# EAGLE design pcb-inductive-sensor2 (EAGLE 9.6.2)
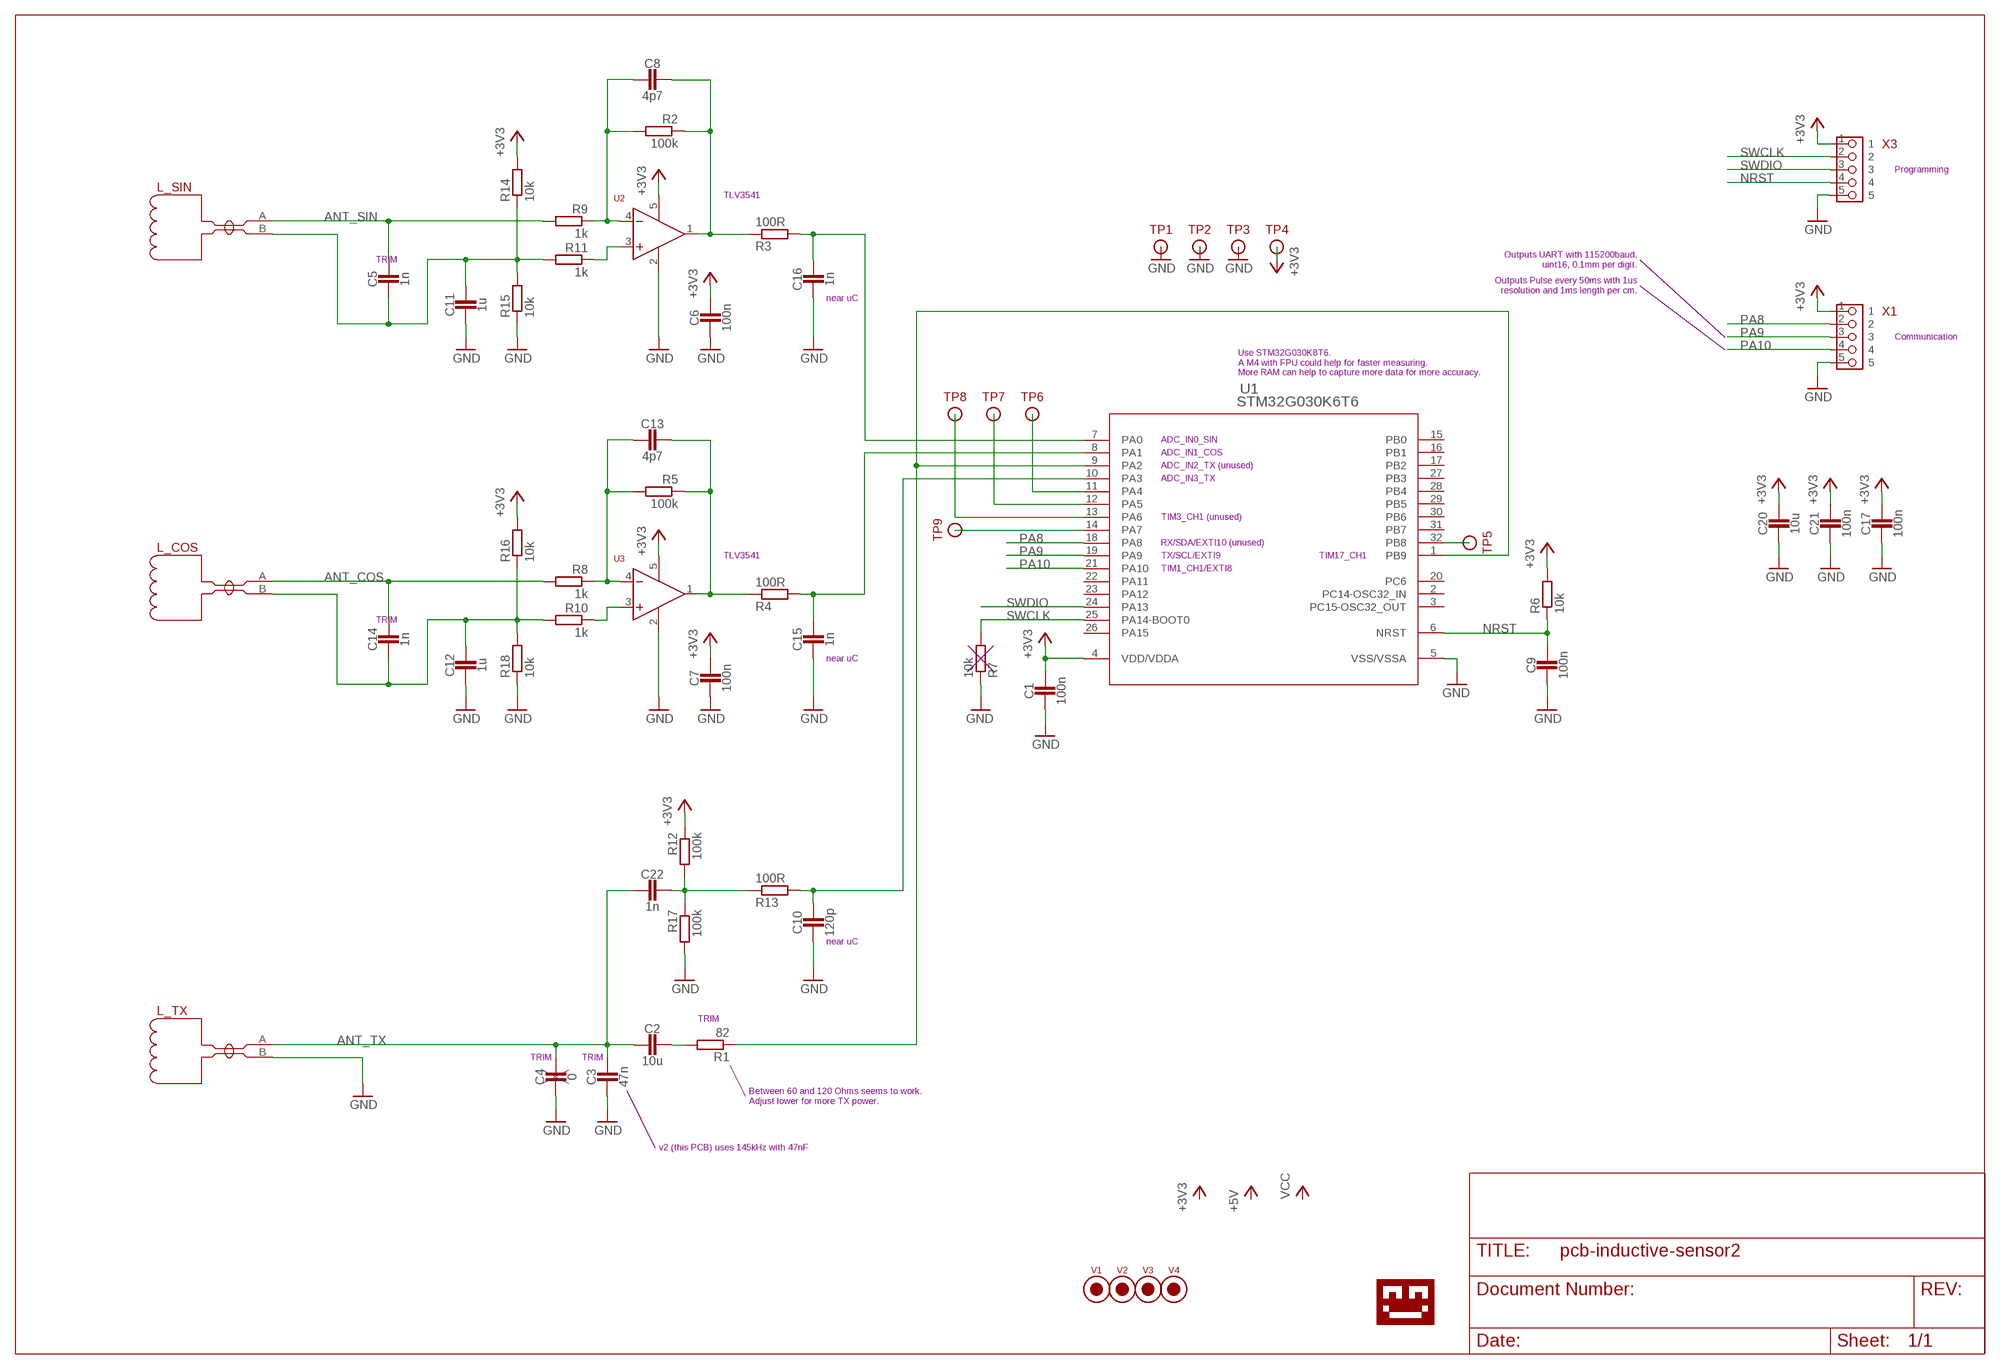
[diagram p0: schematic, sheet 1]

## Parts
C1  100n  CAPACITOR0603_CAP  [0603_CAP]
C2  10u  CAPACITOR0805_CAP  [0805_CAP]
C3  47n  CAPACITOR0603_CAP  [0603_CAP]
C4  0  CAPACITOR0603_CAP  [0603_CAP]
C5  1n  CAPACITOR0603_CAP  [0603_CAP]
C6  100n  CAPACITOR0603_CAP  [0603_CAP]
C7  100n  CAPACITOR0603_CAP  [0603_CAP]
C8  4p7  CAPACITOR0603_CAP  [0603_CAP]
C9  100n  CAPACITOR0603_CAP  [0603_CAP]
C10  120p  CAPACITOR0603_CAP  [0603_CAP]
C11  1u  CAPACITOR0603_CAP  [0603_CAP]
C12  1u  CAPACITOR0603_CAP  [0603_CAP]
C13  4p7  CAPACITOR0603_CAP  [0603_CAP]
C14  1n  CAPACITOR0603_CAP  [0603_CAP]
C15  1n  CAPACITOR0603_CAP  [0603_CAP]
C16  1n  CAPACITOR0603_CAP  [0603_CAP]
C17  100n  CAPACITOR0603_CAP  [0603_CAP]
C20  10u  CAPACITOR0805_CAP  [0805_CAP]
C21  100n  CAPACITOR0603_CAP  [0603_CAP]
C22  1n  CAPACITOR0603_CAP  [0603_CAP]
L_COS  INDUCTION_SENSOR  [INDUCTIVE_SENSOR_NET_TIE]
L_SIN  INDUCTION_SENSOR  [INDUCTIVE_SENSOR_NET_TIE]
L_TX  INDUCTION_SENSOR  [INDUCTIVE_SENSOR_NET_TIE]
R1  82  RESISTOR0805_RES  [0805_RES]
R2  100k  RESISTOR0603_RES  [0603-RES]
R3  100R  RESISTOR0603_RES  [0603-RES]
R4  100R  RESISTOR0603_RES  [0603-RES]
R5  100k  RESISTOR0603_RES  [0603-RES]
R6  10k  RESISTOR0603_RES  [0603-RES]
R7  10k  RESISTOR0603_RES  [0603-RES]
R8  1k  RESISTOR0603_RES  [0603-RES]
R9  1k  RESISTOR0603_RES  [0603-RES]
R10  1k  RESISTOR0603_RES  [0603-RES]
R11  1k  RESISTOR0603_RES  [0603-RES]
R12  100k  RESISTOR0603_RES  [0603-RES]
R13  100R  RESISTOR0603_RES  [0603-RES]
R14  10k  RESISTOR0603_RES  [0603-RES]
R15  10k  RESISTOR0603_RES  [0603-RES]
R16  10k  RESISTOR0603_RES  [0603-RES]
R17  100k  RESISTOR0603_RES  [0603-RES]
R18  10k  RESISTOR0603_RES  [0603-RES]
TP1  TESTPIN  [PIN-SMD-1X1-TEST_1M5]
TP2  TESTPIN  [PIN-SMD-1X1-TEST_1M5]
TP3  TESTPIN  [PIN-SMD-1X1-TEST_1M5]
TP4  TESTPIN  [PIN-SMD-1X1-TEST_1M5]
TP5  TESTPIN  [PIN-SMD-1X1-TEST_1M5]
TP6  TESTPIN  [PIN-SMD-1X1-TEST_1M5]
TP7  TESTPIN  [PIN-SMD-1X1-TEST_1M5]
TP8  TESTPIN  [PIN-SMD-1X1-TEST_1M5]
TP9  TESTPIN  [PIN-SMD-1X1-TEST_1M5]
U1  STM32G030K6T6  [LQFP-32]
U2  OPAMP-TLV3541IDBVT  [SOT-23-5]
U3  OPAMP-TLV3541IDBVT  [SOT-23-5]
U$1  LOGO-TOBENG-1MM-FINISH  [TOBENG-1MM-FINISH]
V1  FIDUCIAL2MM  [FIDUCIAL_2MM]
V2  FIDUCIAL2MM  [FIDUCIAL_2MM]
V3  FIDUCIAL2MM  [FIDUCIAL_2MM]
V4  FIDUCIAL2MM  [FIDUCIAL_2MM]
X1  PIN_5X1HD  [PIN_5X1_HD]
X3  PIN_5X1HD  [PIN_5X1_HD]

## Nets
+3V3: C1.1 C6.1 C7.1 C17.1 C20.P$1 C21.1 R6.2 R12.1 R14.2 R16.2 TP4.1 U1.4(VDD/VDDA) U2.5(VCC) U3.5(VCC) X1.1 X3.1
ANT_COS: C14.1 L_COS.A R8.2
ANT_SIN: C5.1 L_SIN.A R9.2
ANT_TX: C2.P$2 C3.1 C4.1 C22.2 L_TX.A
ANT_TX1: R1.1 U1.1(PB9) U1.9(PA2)
GND: C1.2 C3.2 C4.2 C6.2 C7.2 C9.2 C10.2 C11.2 C12.2 C15.2 C16.2 C17.2 C20.P$2 C21.2 L_TX.B R7.1 R15.1 R17.2 R18.1 TP1.1 TP2.1 TP3.1 U1.5(VSS/VSSA) U2.2(GND) U3.2(GND) X1.5 X3.5
N$1: C16.1 R3.2 U1.7(PA0)
N$2: C15.1 R4.2 U1.8(PA1)
N$3: C10.1 R13.2 U1.10(PA3)
N$4: TP6.1 U1.11(PA4)
N$5: TP7.1 U1.12(PA5)
N$6: TP8.1 U1.13(PA6)
N$7: TP9.1 U1.14(PA7)
N$8: C8.1 R2.1 R3.1 U2.1(OUT)
N$9: C8.2 R2.2 R9.1 U2.4(-)
N$10: TP5.1 U1.32(PB8)
N$11: C13.1 R4.1 R5.1 U3.1(OUT)
N$12: C13.2 R5.2 R8.1 U3.4(-)
N$13: C22.1 R12.2 R13.1 R17.1
N$14: R11.1 U2.3(+)
N$15: R10.1 U3.3(+)
N$16: C2.P$1 R1.2
N$17: C12.1 C14.2 L_COS.B R10.2 R16.1 R18.2
N$18: C5.2 C11.1 L_SIN.B R11.2 R14.1 R15.2
NRST: C9.1 R6.1 U1.6(NRST) X3.4
PA8: U1.18(PA8) X1.2
PA9: U1.19(PA9) X1.3
PA10: U1.21(PA10) X1.4
SWCLK: R7.2 U1.25(PA14-BOOT0) X3.2
SWDIO: U1.24(PA13) X3.3
Unconnected: U1.2(PC14-OSC32_IN) U1.3(PC15-OSC32_OUT) U1.15(PB0) U1.16(PB1) U1.17(PB2) U1.20(PC6) U1.22(PA11) U1.23(PA12) U1.26(PA15) U1.27(PB3) U1.28(PB4) U1.29(PB5) U1.30(PB6) U1.31(PB7)

## Notes on the sheet
- Programming
- TLV3541
- TRIM
- Outputs UART with 115200baud,
  uint16, 0.1mm per digit.
- Outputs Pulse every 50ms with 1us
  resolution and 1ms length per cm.
- near uC
- Communication
- Use STM32G030K8T6.
  A M4 with FPU could help for faster measuring.
  More RAM can help to capture more data for more accuracy.
- ADC_IN0_SIN
- ADC_IN1_COS
- ADC_IN2_TX (unused)
- ADC_IN3_TX
- TIM3_CH1 (unused)
- RX/SDA/EXTI10 (unused)
- TLV3541 | TX/SCL/EXTI9 | TIM17_CH1
- TIM1_CH1/EXTI8
- TRIM
- near uC
- near uC
- TRIM
- TRIM | TRIM
- Between 60 and 120 Ohms seems to work.
  Adjust lower for more TX power.
- v2 (this PCB) uses 145kHz with 47nF

## Library data of the parts
C1-C17 C20-C22 = passives:CAPACITOR: SMD Capacitor
L_COS L_SIN L_TX = ftobler:INDUCTION_SENSOR
R1-R18 = passives:RESISTOR: Resistor Basic schematic elements and footprints for 0201, 0402, 0603, 1206, and PTH resistors.
TP1-TP9 = ftobler:TESTPIN
U1 = stm32:STM32G030K6T6; BUILT_BY: EMA_UL_Team; COPYRIGHT: Copyright (C) 2018 Accelerated Designs. All rights reserved; MANUFACTURER_PART_NUMBER: STM32G030K6T6; SOURCELIBRARY: Updates_to_database_2020-10-19; VENDOR: STMicroelectronics
U2 U3 = ftobler:OPAMP
U$1 = ftobler:LOGO
V1-V4 = ftobler:FIDUCIAL
X1 X3 = ftobler-conn:PIN_5X1

## Board
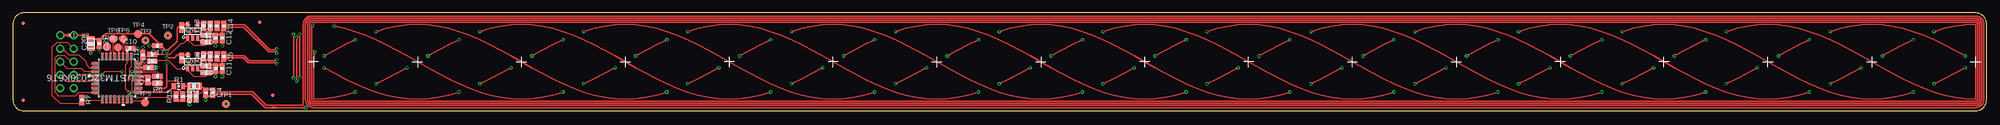
[diagram p1: board, top side]
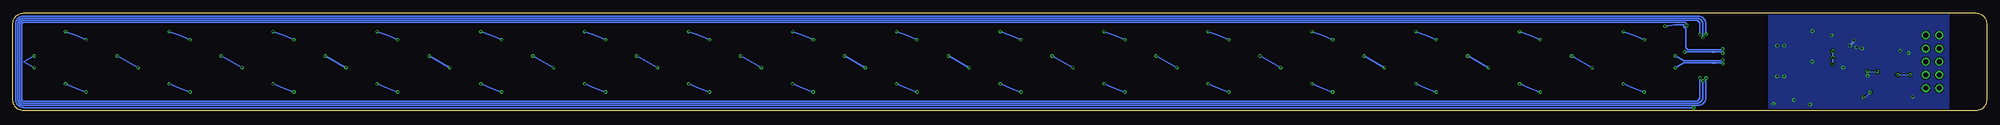
[diagram p2: board, bottom side, seen from below]

Size 380 x 18.8 mm. Coordinates in mm from the lower left corner, seen from the top.
Outline: 0,16.8 0,2 arc90 2,0 378,0 arc90 380,2 380,16.8 arc90 378,18.8 2,18.8 arc90 0,16.8
Copper layers (1*16): Top 0.035mm / dielectric 1.5mm / Bottom 0.035mm
Design rules "default *": minimum track width 0.15mm, minimum drill 0.3mm, track to track 0.15mm, track to pad 0.15mm, pad to pad 0.15mm, via to via 0.15mm, smd to smd 0.15mm, copper to edge 0.3mm, drill to drill 10mil, minimum pad ring 0.15mm, minimum via ring 0.15mm, stop-mask expansion 0.05mm, vias tented up to drill 0.35mm, thermal gap 0.2mm

### Footprints (pad centres in the part's own frame; a part is rotated, then mirrored left to right if it is on the bottom)
0603_CAP = smd 0.7 x 1: 1 -0.65,0; 2 0.65,0
0805_CAP = smd 0.8 x 1.4: P$1 1,0; P$2 -1,0
INDUCTIVE_SENSOR_NET_TIE = smd 0.2 x 0.2: A -0.2,0; B 0.2,0
0805_RES = smd 0.8 x 1.2: 1 -0.9,0; 2 0.9,0
0603-RES = smd 0.7 x 1: 1 -0.65,0; 2 0.65,0
PIN-SMD-1X1-TEST_1M5 = smd 1.5 x 1.5: 1 0,0
LQFP-32 = smd 1.473 x 0.508: 1 -4.115,2.8; 2 -4.115,2; 3 -4.115,1.2; 4 -4.115,0.4; 5 -4.115,-0.4; 6 -4.115,-1.2; 7 -4.115,-2; 8 -4.115,-2.8; 17 4.115,-2.8; 18 4.115,-2; 19 4.115,-1.2; 20 4.115,-0.4; 21 4.115,0.4; 22 4.115,1.2; 23 4.115,2; 24 4.115,2.8 | smd 0.508 x 1.473: 9 -2.8,-4.115; 10 -2,-4.115; 11 -1.2,-4.115; 12 -0.4,-4.115; 13 0.4,-4.115; 14 1.2,-4.115; 15 2,-4.115; 16 2.8,-4.115; 25 2.8,4.115; 26 2,4.115; 27 1.2,4.115; 28 0.4,4.115; 29 -0.4,4.115; 30 -1.2,4.115; 31 -2,4.115; 32 -2.8,4.115
SOT-23-5 = smd 1 x 0.55: 1 -1.35,0.95; 2 -1.35,0; 3 -1.35,-0.95; 4 1.35,-0.95; 5 1.35,0.95
FIDUCIAL_2MM = smd 0.7 x 0.7: V 0,0
PIN_5X1_HD = drill 0.9 pad 1.54 octagon: 1 0,0 | drill 0.9 pad 1.54: 2 0,-2.54; 3 0,-5.08; 4 0,-7.62; 5 0,-10.16

### Placement (x,y rotation side)
C1  26,5.9 90 top
C2  34.9,4.7 180 top
C3  37.1,3.45 270 top
C4  38.45,3.45 270 top
C5  40.6,10.4 270 top
C6  32.5,10.1 270 top
C7  32.5,16 270 top
C8  36.7,10.4 90 top
C9  27.8,6.6 180 top
C10  22.5,12 0 top
C11  40.3,8.1 270 top
C12  40.3,14 270 top
C13  36.7,16.3 90 top
C14  40.6,16.3 270 top
C15  25,10.7 90 top
C16  26.1,8.3 0 top
C17  27.8,12.5 180 top
C20  15,12.9 90 top
C21  16.6,12.9 270 top
C22  35.3,2.7 90 top
L_COS  52.5,11.3 0 bottom
L_SIN  52.5,9.2 0 bottom
L_TX  50.3,0.6 180 top
R1  31.9,4.7 0 top
R2  38,10.4 90 top
R3  26.8,9.5 180 top
R4  26.8,10.8 180 top
R5  38,16.3 90 top
R6  27.8,5.3 180 top
R7  13.25,2.05 270 top
R8  39.3,16.3 90 top
R9  39.3,10.4 90 top
R10  37.2,13.2 0 top
R11  37.2,7.3 0 top
R12  32.7,2.7 270 top
R13  31.4,2.7 90 top
R14  37.2,8.6 180 top
R15  39,8.1 90 top
R16  37.2,14.5 180 top
R17  34,2.7 270 top
R18  39,14 90 top
TP1  41,1.3 0 top
TP2  29.8,14.5 0 top
TP3  25.55,13.55 0 top
TP4  24.1,14.8 0 top
TP5  25.4,1.6 0 top
TP6  21.25,13.75 0 top
TP7  20.2,12.15 0 top
TP8  19.3,13.75 0 top
TP9  18.1,12.3 0 top
U1  20,6.3 180 top
U2  34.6,9.4 90 top
U3  34.6,15.3 90 top
U$1  47.6,9.4 0 top
V1  2,16.8 0 top
V2  47.5,17 0 top
V3  50,3 0 top
V4  2,2 0 top
X1  9.1,14.5 0 top
X3  11.7,14.5 0 top

### Tracks (layer width: path | path; a pad name or v marks a point on that pad's centre or on a via)
+3V3  (via drill 0.35)
  Top 0.2: C1.1 26.05,5.3 | R14.2 35.75,9.4 34.8,9.4 33.65,10.55 U2.5 | R16.2 35.75,15.3 34.8,15.3 33.65,16.45 U3.5 | R12.1 31.8,4.25 31.8,5.4 31.5,5.7 29.6,5.7
  Top 0.3: 26.05,5.3 R6.2 27.15,5.25 28.1,4.3 29.3,4.3 29.6,4.6 29.6,5.7 v29.6,9.03 | U1.4 25.2,5.9 25.85,5.25 C1.1 | X3.1 14.2,14.5 14.8,13.9 C20.P$1 15.2,13.7 16.45,13.7 C21.1 17.85,14.8 TP4.1 26.2,14.8 28.5,12.5 | U2.5 C6.1 31.65,10.75 31.1,10.2 v29.6,10.2 | U3.5 C7.1 32.4,16.65 31.6,15.85 31.6,13.4 v29.6,11.4 28.55,12.45 28.5,12.5 | C17.1 28.5,12.5
  Top 0.5: X1.1 X3.1
  Bottom 0.3: v29.6,9.03 v29.6,10.2 v29.6,11.4
ANT_COS  (via drill 0.3 pad 0.6)
  Top 0.2: C14.1 R8.2
  Top 0.25: v119.9,10.53 121.9,11.62 123.9,12.67 v125.9,13.63 | v129.9,15.22 131.9,15.82 133.9,16.25 135.9,16.51 137.9,16.6 139.9,16.51 141.9,16.25 143.9,15.82 145.9,15.22 147.9,14.49 149.9,13.63 151.9,12.67 153.9,11.62 155.9,10.53 159.9,8.27 161.9,7.18 163.9,6.13 165.9,5.17 167.9,4.31 169.9,3.58 171.9,2.98 173.9,2.55 175.9,2.29 177.9,2.2 179.9,2.29 181.9,2.55 183.9,2.98 v185.9,3.58 | v115.9,8.27 113.9,7.18 111.9,6.13 v109.9,5.17 | v105.9,3.58 103.9,2.98 101.9,2.55 99.9,2.29 97.9,2.2 95.9,2.29 93.9,2.55 91.9,2.98 89.9,3.58 87.9,4.31 85.9,5.17 83.9,6.13 81.9,7.18 79.9,8.27 75.9,10.53 73.9,11.62 71.9,12.67 69.9,13.63 67.9,14.49 65.9,15.22 63.9,15.82 v61.9,16.25 | v199.9,10.53 201.9,11.62 203.9,12.67 v205.9,13.63 | v209.9,15.22 211.9,15.82 213.9,16.25 215.9,16.51 217.9,16.6 219.9,16.51 221.9,16.25 223.9,15.82 225.9,15.22 227.9,14.49 229.9,13.63 231.9,12.67 233.9,11.62 235.9,10.53 239.9,8.27 241.9,7.18 243.9,6.13 245.9,5.17 247.9,4.31 249.9,3.58 251.9,2.98 253.9,2.55 255.9,2.29 257.9,2.2 259.9,2.29 261.9,2.55 263.9,2.98 v265.9,3.58 | v195.9,8.27 193.9,7.18 191.9,6.13 v189.9,5.17 | v279.9,10.53 281.9,11.62 283.9,12.67 v285.9,13.63 | v289.9,15.22 291.9,15.82 293.9,16.25 295.9,16.51 297.9,16.6 299.9,16.51 301.9,16.25 303.9,15.82 305.9,15.22 307.9,14.49 309.9,13.63 311.9,12.67 313.9,11.62 315.9,10.53 319.9,8.27 321.9,7.18 323.9,6.13 325.9,5.17 327.9,4.31 329.9,3.58 331.9,2.98 333.9,2.55 335.9,2.29 337.9,2.2 339.9,2.29 341.9,2.55 343.9,2.98 v345.9,3.58 | v275.9,8.27 273.9,7.18 271.9,6.13 v269.9,5.17 | v359.9,10.53 361.9,11.62 363.9,12.67 v365.9,13.63
  Top 0.25: v369.9,15.22 371.9,15.82 373.9,16.25 375.9,16.51 377.9,16.6 377.9,2.2 375.9,2.29 373.9,2.55 371.9,2.98 369.9,3.58 367.9,4.31 365.9,5.17 363.9,6.13 361.9,7.18 359.9,8.27 355.9,10.53 353.9,11.62 351.9,12.67 349.9,13.63 347.9,14.49 345.9,15.22 343.9,15.82 341.9,16.25 339.9,16.51 337.9,16.6 335.9,16.51 333.9,16.25 331.9,15.82 v329.9,15.22 | v355.9,8.27 353.9,7.18 351.9,6.13 v349.9,5.17 | v155.9,8.27 153.9,7.18 151.9,6.13 v149.9,5.17 | v145.9,3.58 143.9,2.98 141.9,2.55 139.9,2.29 137.9,2.2 135.9,2.29 133.9,2.55 131.9,2.98 129.9,3.58 127.9,4.31 125.9,5.17 123.9,6.13 121.9,7.18 119.9,8.27 115.9,10.53 113.9,11.62 111.9,12.67 109.9,13.63 107.9,14.49 105.9,15.22 103.9,15.82 101.9,16.25 99.9,16.51 97.9,16.6 95.9,16.51 93.9,16.25 91.9,15.82 v89.9,15.22 | v79.9,10.53 81.9,11.62 83.9,12.67 v85.9,13.63 | v235.9,8.27 233.9,7.18 231.9,6.13 v229.9,5.17 | v225.9,3.58 223.9,2.98 221.9,2.55 219.9,2.29 217.9,2.2 215.9,2.29 213.9,2.55 211.9,2.98 209.9,3.58 207.9,4.31 205.9,5.17 203.9,6.13 201.9,7.18 199.9,8.27 195.9,10.53 193.9,11.62 191.9,12.67 189.9,13.63 187.9,14.49 185.9,15.22 183.9,15.82 181.9,16.25 179.9,16.51 177.9,16.6 175.9,16.51 173.9,16.25 171.9,15.82 v169.9,15.22 | v159.9,10.53 161.9,11.62 163.9,12.67 v165.9,13.63 | v315.9,8.27 313.9,7.18 311.9,6.13 v309.9,5.17 | v305.9,3.58 303.9,2.98 301.9,2.55 299.9,2.29 297.9,2.2 295.9,2.29 293.9,2.55 291.9,2.98 289.9,3.58 287.9,4.31 285.9,5.17 283.9,6.13 281.9,7.18 279.9,8.27 275.9,10.53 273.9,11.62 271.9,12.67 269.9,13.63 267.9,14.49 265.9,15.22 263.9,15.82 261.9,16.25 259.9,16.51 257.9,16.6 255.9,16.51 253.9,16.25 251.9,15.82 v249.9,15.22
  Top 0.25: v239.9,10.53 241.9,11.62 243.9,12.67 v245.9,13.63 | v319.9,10.53 321.9,11.62 323.9,12.67 v325.9,13.63 | v75.9,8.27 73.9,7.18 71.9,6.13 v69.9,5.17 | v65.9,3.58 63.9,2.98 61.9,2.55 59.9,2.29 57.9,2.2 57.9,10.1 v58.1,11.3 | C14.1 40.75,16.95 41.2,16.5 44.6,16.5 49.4,11.7 50.6,11.7 v50.8,11.9
  Bottom 0.25: v125.9,13.63 127.9,14.49 v129.9,15.22 | v119.9,10.53 v115.9,8.27 | v109.9,5.17 107.9,4.31 v105.9,3.58 | v205.9,13.63 207.9,14.49 v209.9,15.22 | v199.9,10.53 v195.9,8.27 | v189.9,5.17 187.9,4.31 v185.9,3.58 | v285.9,13.63 287.9,14.49 v289.9,15.22 | v279.9,10.53 v275.9,8.27 | v269.9,5.17 267.9,4.31 v265.9,3.58 | v365.9,13.63 367.9,14.49 v369.9,15.22 | v359.9,10.53 v355.9,8.27 | v349.9,5.17 347.9,4.31 v345.9,3.58 | v61.9,16.25 59.9,16.51 58.3,16.58 58.3,16.4 arc-53 58.06,15.92 57.9,15.8 57.9,12.1 57.5,11.7 51,11.7 v50.8,11.9 | v149.9,5.17 147.9,4.31 v145.9,3.58 | v85.9,13.63 87.9,14.49 v89.9,15.22 | v229.9,5.17 227.9,4.31 v225.9,3.58 | v155.9,8.27 v159.9,10.53 | v165.9,13.63 167.9,14.49 v169.9,15.22 | v309.9,5.17 307.9,4.31 v305.9,3.58 | v235.9,8.27 v239.9,10.53 | v245.9,13.63 247.9,14.49 v249.9,15.22 | v315.9,8.27 v319.9,10.53 | v325.9,13.63 327.9,14.49 v329.9,15.22 | v79.9,10.53 v75.9,8.27 | v69.9,5.17 67.9,4.31 v65.9,3.58 | v58.1,11.3 L_COS.A
ANT_SIN  (via drill 0.3 pad 0.6)
  Top 0.2: C5.1 R9.2
  Top 0.25: v135.9,8.27 133.9,7.18 131.9,6.13 v129.9,5.17 | v125.9,3.58 123.9,2.98 121.9,2.55 119.9,2.29 117.9,2.2 115.9,2.29 113.9,2.55 111.9,2.98 109.9,3.58 107.9,4.31 105.9,5.17 103.9,6.13 101.9,7.18 99.9,8.27 95.9,10.53 93.9,11.62 91.9,12.67 89.9,13.63 87.9,14.49 85.9,15.22 83.9,15.82 81.9,16.25 79.9,16.51 77.9,16.6 75.9,16.51 73.9,16.25 71.9,15.82 v69.9,15.22 | v59.9,10.53 61.9,11.62 63.9,12.67 v65.9,13.63 | v215.9,8.27 213.9,7.18 211.9,6.13 v209.9,5.17 | v205.9,3.58 203.9,2.98 201.9,2.55 199.9,2.29 197.9,2.2 195.9,2.29 193.9,2.55 191.9,2.98 189.9,3.58 187.9,4.31 185.9,5.17 183.9,6.13 181.9,7.18 179.9,8.27 175.9,10.53 173.9,11.62 171.9,12.67 169.9,13.63 167.9,14.49 165.9,15.22 163.9,15.82 161.9,16.25 159.9,16.51 157.9,16.6 155.9,16.51 153.9,16.25 151.9,15.82 v149.9,15.22 | v139.9,10.53 141.9,11.62 143.9,12.67 v145.9,13.63 | v295.9,8.27 293.9,7.18 291.9,6.13 v289.9,5.17 | v285.9,3.58 283.9,2.98 281.9,2.55 279.9,2.29 277.9,2.2 275.9,2.29 273.9,2.55 271.9,2.98 269.9,3.58 267.9,4.31 265.9,5.17 263.9,6.13 261.9,7.18 259.9,8.27 255.9,10.53 253.9,11.62 251.9,12.67 249.9,13.63 247.9,14.49 245.9,15.22 243.9,15.82 241.9,16.25 239.9,16.51 237.9,16.6 235.9,16.51 233.9,16.25 231.9,15.82 v229.9,15.22 | v219.9,10.53 221.9,11.62 223.9,12.67 v225.9,13.63 | v375.9,8.27 373.9,7.18 371.9,6.13 v369.9,5.17 | v365.9,3.58 363.9,2.98 361.9,2.55 359.9,2.29 357.9,2.2 355.9,2.29 353.9,2.55 351.9,2.98 349.9,3.58 347.9,4.31 345.9,5.17 343.9,6.13 341.9,7.18 339.9,8.27 335.9,10.53 333.9,11.62 331.9,12.67 329.9,13.63 327.9,14.49 325.9,15.22 323.9,15.82 321.9,16.25 319.9,16.51 317.9,16.6 315.9,16.51 313.9,16.25 311.9,15.82 v309.9,15.22
  Top 0.25: v299.9,10.53 301.9,11.62 303.9,12.67 v305.9,13.63 | v99.9,10.53 101.9,11.62 103.9,12.67 v105.9,13.63 | v109.9,15.22 111.9,15.82 113.9,16.25 115.9,16.51 117.9,16.6 119.9,16.51 121.9,16.25 123.9,15.82 125.9,15.22 127.9,14.49 129.9,13.63 131.9,12.67 133.9,11.62 135.9,10.53 139.9,8.27 141.9,7.18 143.9,6.13 145.9,5.17 147.9,4.31 149.9,3.58 151.9,2.98 153.9,2.55 155.9,2.29 157.9,2.2 159.9,2.29 161.9,2.55 163.9,2.98 v165.9,3.58 | v95.9,8.27 93.9,7.18 91.9,6.13 v89.9,5.17 | v85.9,3.58 83.9,2.98 81.9,2.55 79.9,2.29 77.9,2.2 75.9,2.29 73.9,2.55 71.9,2.98 69.9,3.58 67.9,4.31 65.9,5.17 63.9,6.13 61.9,7.18 v59.9,8.27 | v179.9,10.53 181.9,11.62 183.9,12.67 v185.9,13.63 | v189.9,15.22 191.9,15.82 193.9,16.25 195.9,16.51 197.9,16.6 199.9,16.51 201.9,16.25 203.9,15.82 205.9,15.22 207.9,14.49 209.9,13.63 211.9,12.67 213.9,11.62 215.9,10.53 219.9,8.27 221.9,7.18 223.9,6.13 225.9,5.17 227.9,4.31 229.9,3.58 231.9,2.98 233.9,2.55 235.9,2.29 237.9,2.2 239.9,2.29 241.9,2.55 243.9,2.98 v245.9,3.58 | v175.9,8.27 173.9,7.18 171.9,6.13 v169.9,5.17 | v259.9,10.53 261.9,11.62 263.9,12.67 v265.9,13.63 | v269.9,15.22 271.9,15.82 273.9,16.25 275.9,16.51 277.9,16.6 279.9,16.51 281.9,16.25 283.9,15.82 285.9,15.22 287.9,14.49 289.9,13.63 291.9,12.67 293.9,11.62 295.9,10.53 299.9,8.27 301.9,7.18 303.9,6.13 305.9,5.17 307.9,4.31 309.9,3.58 311.9,2.98 313.9,2.55 315.9,2.29 317.9,2.2 319.9,2.29 321.9,2.55 323.9,2.98 v325.9,3.58 | v255.9,8.27 253.9,7.18 251.9,6.13 v249.9,5.17 | v339.9,10.53 341.9,11.62 343.9,12.67 v345.9,13.63 | v349.9,15.22 351.9,15.82 353.9,16.25 355.9,16.51 357.9,16.6 359.9,16.51 361.9,16.25 363.9,15.82 365.9,15.22 367.9,14.49 369.9,13.63 371.9,12.67 373.9,11.62 v375.9,10.53
  Top 0.25: v335.9,8.27 333.9,7.18 331.9,6.13 v329.9,5.17 | v50.8,9.8 50.6,9.6 45.5,9.6 44.5,10.6 41.2,10.6 40.75,11.05 C5.1
  Bottom 0.25: v129.9,5.17 127.9,4.31 v125.9,3.58 | v59.9,10.53 58.25,9.6 51,9.6 v50.8,9.8 | v65.9,13.63 67.9,14.49 v69.9,15.22 | v209.9,5.17 207.9,4.31 v205.9,3.58 | v135.9,8.27 v139.9,10.53 | v145.9,13.63 147.9,14.49 v149.9,15.22 | v289.9,5.17 287.9,4.31 v285.9,3.58 | v215.9,8.27 v219.9,10.53 | v225.9,13.63 227.9,14.49 v229.9,15.22 | v375.9,8.27 377.9,9.4 v375.9,10.53 | v369.9,5.17 367.9,4.31 v365.9,3.58 | v295.9,8.27 v299.9,10.53 | v305.9,13.63 307.9,14.49 v309.9,15.22 | v105.9,13.63 107.9,14.49 v109.9,15.22 | v99.9,10.53 v95.9,8.27 | v89.9,5.17 87.9,4.31 v85.9,3.58 | v59.9,8.27 58.25,9.2 L_SIN.A | v185.9,13.63 187.9,14.49 v189.9,15.22 | v179.9,10.53 v175.9,8.27 | v169.9,5.17 167.9,4.31 v165.9,3.58 | v265.9,13.63 267.9,14.49 v269.9,15.22 | v259.9,10.53 v255.9,8.27 | v249.9,5.17 247.9,4.31 v245.9,3.58 | v345.9,13.63 347.9,14.49 v349.9,15.22 | v339.9,10.53 v335.9,8.27 | v329.9,5.17 327.9,4.31 v325.9,3.58
ANT_TX  (via drill 0.3 pad 0.6)
  Top 0.2: C22.2 36.15,3.35 36.9,4.1 C3.1
  Top 0.25: v57.7,16.4 arc90 57.5,16.2 57.5,2.2 arc90 57.9,1.8 377.9,1.8 arc90 378.3,2.2 378.3,16.6 arc90 377.9,17 57.5,17 arc90 57.1,16.6 57.1,2.2 arc90 57.9,1.4 377.9,1.4 arc90 378.7,2.2 378.7,16.6 arc90 377.9,17.4 57.5,17.4 arc90 56.7,16.6 56.7,2.2 arc90 57.9,1 377.9,1 arc90 379.1,2.2 379.1,16.6 arc90 377.9,17.8 57.5,17.8 arc90 56.3,16.6 56.3,2.2 arc90 57.9,0.6 377.9,0.6 arc90 379.5,2.2 379.5,16.6 arc90 377.9,18.2 57.5,18.2 arc90 55.9,16.6 55.9,1 48.8,1 46.2,3.6 39.1,3.6 38.6,4.1 C4.1 C3.1 | v55.2,6.3 v55.2,14.7 | v54.6,5.7 v54.6,14.1 | v54,6.3 v54,14.7 | L_TX.A v56.4,0.6 | C2.P$2 36.1,4.5
  Top 0.3: 36.1,4.5 36.5,4.5 36.9,4.1
  Bottom 0.25: v57.7,16.4 57.7,16.5 arc-90 58.2,17 377.9,17 arc-90 378.3,16.6 378.3,2.2 arc-90 377.9,1.8 56,1.8 arc-90 55.2,2.6 v55.2,6.3 | v55.2,14.7 55.2,16.6 arc-90 56,17.4 377.9,17.4 arc-90 378.7,16.6 378.7,2.2 arc-90 377.9,1.4 55.8,1.4 arc-90 54.6,2.6 v54.6,5.7 | v54.6,14.1 54.6,16.6 arc-90 55.8,17.8 377.9,17.8 arc-90 379.1,16.6 379.1,2.2 arc-90 377.9,1 55.6,1 arc-90 54,2.6 v54,6.3 | v54,14.7 54,16.6 arc-90 55.6,18.2 377.9,18.2 arc-90 379.5,16.6 379.5,2.2 arc-90 377.9,0.6 v56.4,0.6
ANT_TX1
  Top 0.2: U1.9 22.8,8.48 22.35,8.03 22.35,6.27 22.9,5.72 22.9,3.8 23.2,3.5 U1.1 | R1.1 31.07,4.76
  Top 0.3: U1.1 29.8,3.5 R1.1
GND  (via drill 0.3 pad 0.6, 0.35)
  Top 0.2: C1.2 27.1,6.55 C9.2 | R7.1 v14.2,2.7 | R18.1 v39,12.5 | R15.1 v39,6.6 | R17.2 v34,1.2
  Top 0.25: L_TX.B 48.6,0.6 46,3.2 39.1,3.2 38.7,2.8 C4.2 C3.2
  Top 0.3: C1.2 25.85,6.7 U1.5 v22.9,6.7 | C3.2 v37.1,2.05 | C20.P$2 v15,11.1 | C21.2 v16.6,11.5 | C15.2 v25,12.2 | C16.2 v27.6,8.3 | C7.2 v33.55,15.35 34.6,14.3 U3.2 | C6.2 v33.55,9.45 34.6,8.4 U2.2 | C10.2 v24,12 | C12.2 v40.3,12.5 | C11.2 v40.3,6.6 | C17.2 v26.3,12.5
  Bottom 0.3: v26.3,12.5 25.55,13.25 TP3.1
  other vias: 29.8,14.5 41,1.3 25.55,13.55
  pour Bottom (rank 3): 7.2,20.4 42,20.4 42,-1.6 7.2,-1.6
N$1
  Top 0.2: C16.1 25.45,8.55 26.2,9.3 26.2,9.45 R3.2
  Top 0.25: U1.7 C16.1
N$2
  Top 0.2: R4.2 26.15,10.6 25.95,10.4 25.55,10.4 25.2,10.05 C15.1
  Top 0.25: C15.1 24.7,9.75 24.7,9.1 U1.8
N$3  (via drill 0.3 pad 0.6)
  Top 0.2: v22.35,3.5 21.6,4.25 21.6,8.7 22,9.1 U1.10 22,11.85 C10.1 | R13.2 31.25,3.35 30.5,2.6 v23.7,2.6
  Bottom 0.2: v23.7,2.6 23.25,2.6 v22.35,3.5
N$4
  Top 0.2: 21.34,14.05 TP6.1 21.2,13.7 U1.11
N$5
  Top 0.2: TP7.1 20.4,11.95 U1.12
N$6
  Top 0.2: TP8.1 19.3,12.66 19.2,12.56 19.2,11.5 19.4,11.3 19.4,11.21 19.6,11.02 U1.13
N$7
  Top 0.2: TP9.1 18.8,11.6 U1.14
N$8
  Top 0.2: R2.1 C8.1 37.2,9.25 37.2,6.7 37.05,6.55 34.85,6.55 33.65,7.75 U2.1 31.55,8.05 30,9.6 27.55,9.6 R3.1
N$9
  Top 0.2: U2.4 35.55,11.05 C8.2 R2.2 R9.1
N$10
  Top 0.2: U1.32 22.9,2.08 22.9,1.9 25.52,1.9 TP5.1
N$11
  Top 0.2: R5.1 C13.1 37.2,15.15 37.2,12.6 37.05,12.45 34.85,12.45 33.65,13.65 U3.1 33.65,13.75 32.75,12.85 32.25,12.85 30.2,10.8 R4.1
N$12
  Top 0.2: U3.4 35.55,16.95 C13.2 R5.2 R8.1
N$13
  Top 0.2: R13.1 R12.2 R17.1 C22.1
N$14
  Top 0.2: U2.3 35.55,7.7 36.3,7.7 36.55,7.45 R11.1
N$15
  Top 0.2: U3.3 35.55,13.6 36.3,13.6 36.55,13.35 R10.1
N$16
  Top 0.3: R1.2 C2.P$1
N$17  (via drill 0.3 pad 0.6)
  Top 0.2: R10.2 R16.1 38,14.65 R18.2
  Top 0.25: C14.2 40.65,15.7 | v50.8,11.1 50.6,11.3 49.2,11.3 44.4,16.1 41.2,16.1 40.75,15.65 C14.2 | C14.2 40.3,15.35 C12.1 R18.2
  Bottom 0.25: v50.8,11.1 51,11.3 L_COS.B
N$18  (via drill 0.3 pad 0.6)
  Top 0.2: R11.2 R14.1 38,8.75 R15.2
  Top 0.25: v50.8,9 50.6,9.2 45.33,9.2 44.33,10.2 41.2,10.2 40.75,9.75 C5.2 40.3,9.45 C11.1 R15.2
  Bottom 0.25: v50.8,9 51,9.2 L_SIN.B
NRST  (via drill 0.3 pad 0.6)
  Top 0.2: R6.1 28.4,5.35 28.45,5.4 C9.1 28.45,6.85 27.8,7.5 U1.6 v22.9,7.5 | v21.05,7.5 17.7,7.5 v17.1,6.9 | v14.7,6.9 14.68,6.88 X3.4
  Bottom 0.2: v22.9,7.5 v21.05,7.5 | v17.1,6.9 v14.7,6.9
PA8
  Top 0.2: U1.18 14.7,8.3 14.1,8.9 14.1,9.4 12.8,10.7 10.86,10.7 9.6,11.96 X1.2
PA9
  Top 0.2: U1.19 13.8,7.5 13.2,8.1 10.42,8.1 X1.3
PA10
  Top 0.2: X1.4 10.38,5.6 14.48,5.6 14.79,5.9 U1.21
SWCLK
  Top 0.2: U1.25 16.91,1.9 13.85,1.9 13.35,1.4 R7.2 9.1,1.4 7.6,2.9 7.6,12.3 8.5,13.2 10.46,13.2 X3.2
SWDIO
  Top 0.2: X3.3 11.18,9.42 9.9,10.7 8.6,10.7 8,10.1 8,3.6 8.7,2.9 12.1,2.9 12.7,3.5 U1.24

### Text on the board
tFinish: V2 | V1 | cos | pcb-inductive-sensor v2 / 2024 by ftobler | 3V3 | + | C | sin | PA8 | PA9 | D | PA10 | R | GND | G | tx | V3 | V4 | JLCJLCJLCJLCJLCJLC